# EAGLE design labwiz-module_full_breakout (EAGLE 6.5.0)

## Sheet 1 of 2
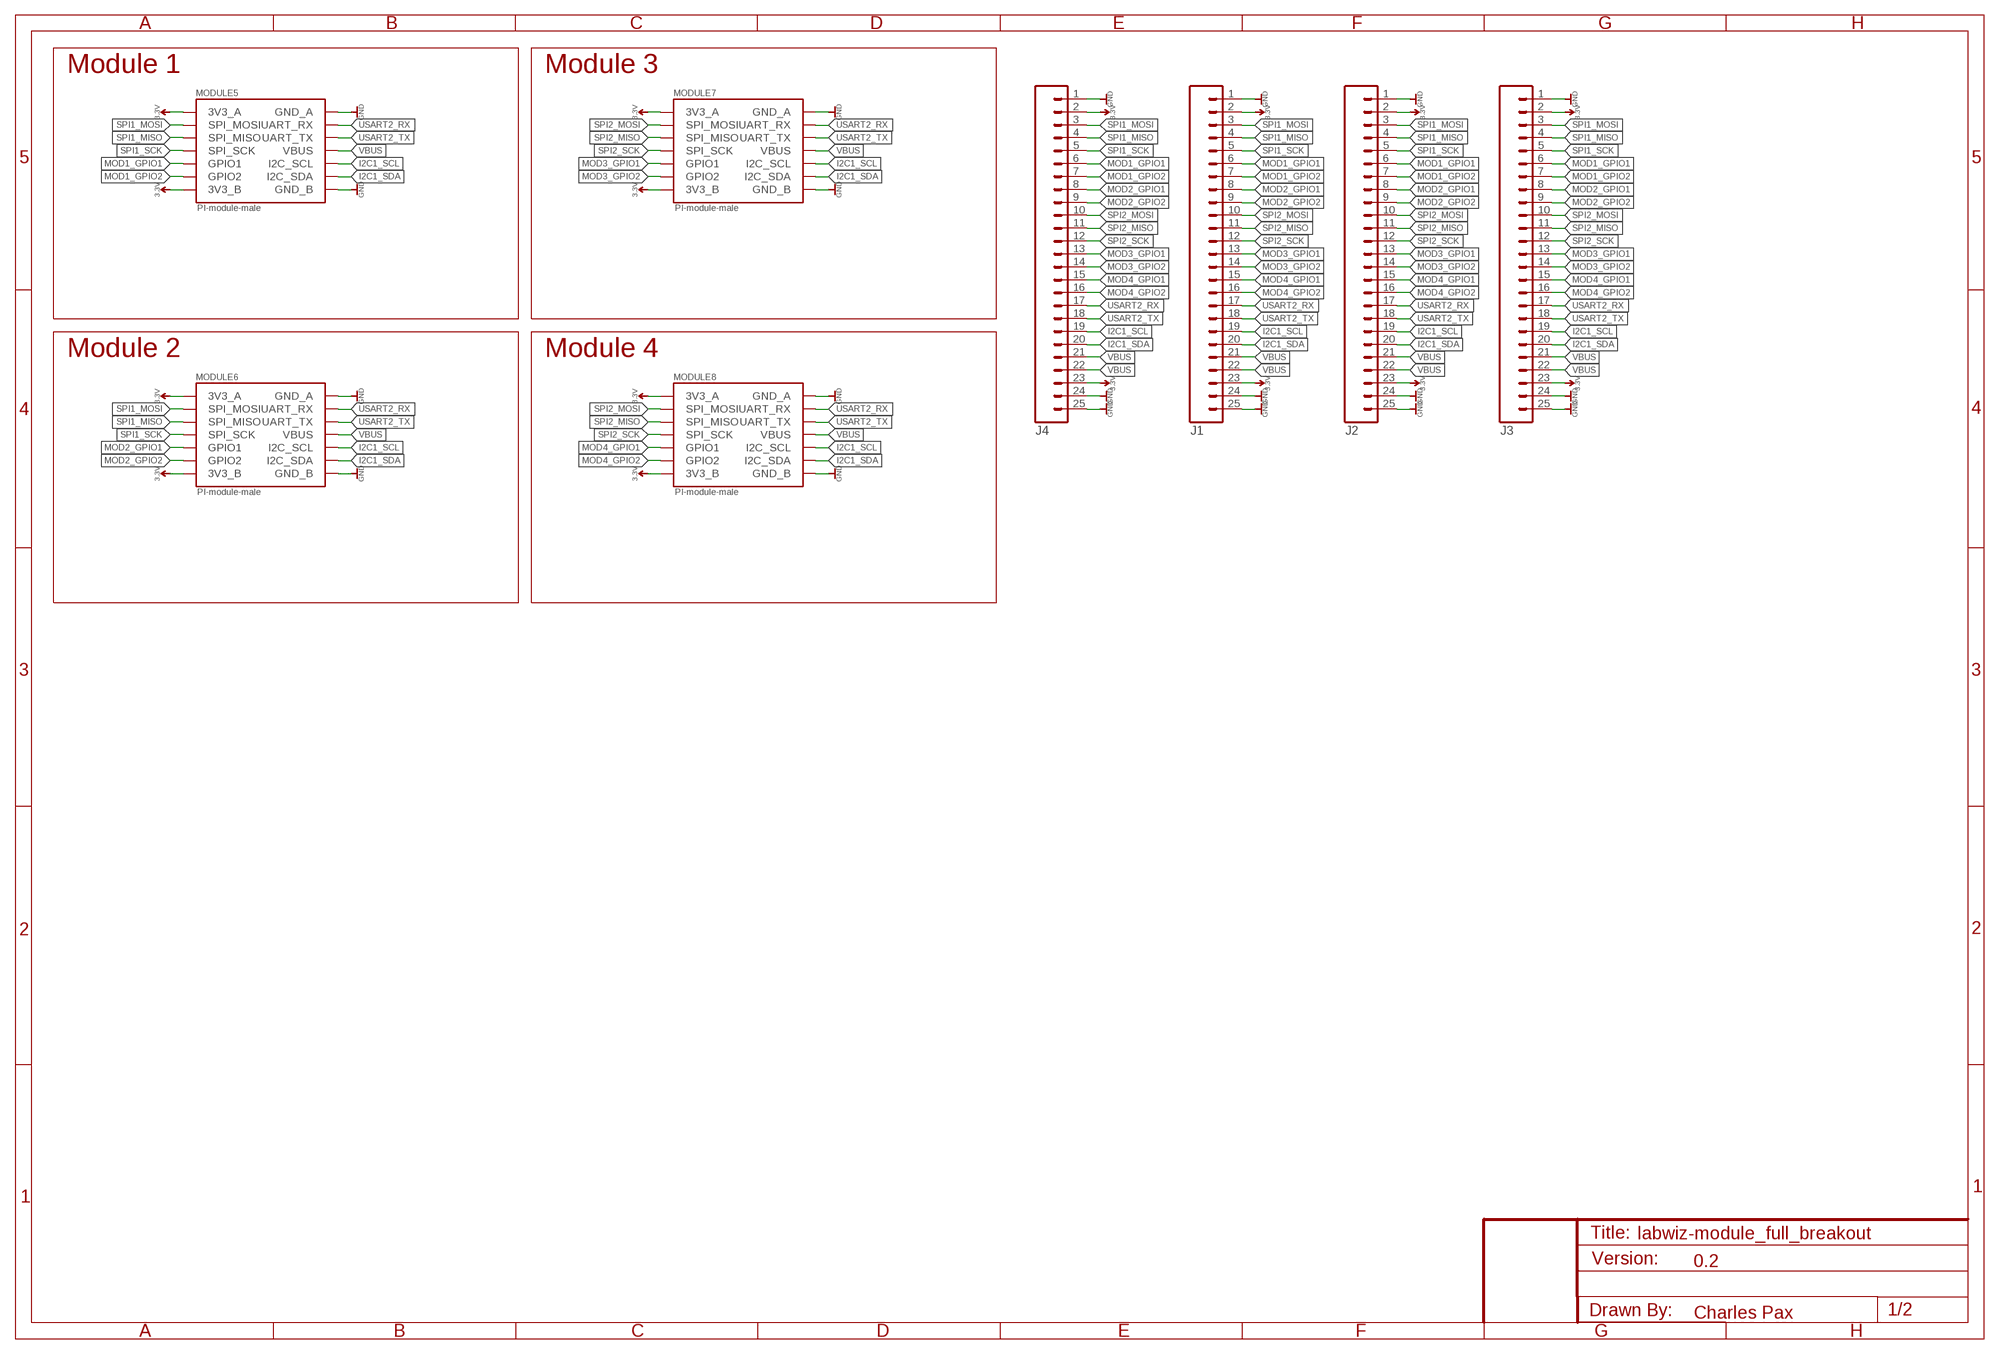
[diagram p0: schematic, sheet 1]

### Parts
J1  M25PTH  [1X25]
J2  M25PTH  [1X25]
J3  M25PTH  [1X25]
J4  M25PTH  [1X25]
MODULE5  PI-module-male  PAX_MODULE_EDGE_MALE_MODULE  [M07X2_2MM_EDGE]
MODULE6  PI-module-male  PAX_MODULE_EDGE_MALE_MODULE  [M07X2_2MM_EDGE]
MODULE7  PI-module-male  PAX_MODULE_EDGE_MALE_MODULE  [M07X2_2MM_EDGE]
MODULE8  PI-module-male  PAX_MODULE_EDGE_MALE_MODULE  [M07X2_2MM_EDGE]

### Nets
3.3V: J1.2 J1.23 J2.2 J2.23 J3.2 J3.23 J4.2 J4.23 MODULE5.P$1(3V3_B) MODULE5.P$13(3V3_A) MODULE6.P$1(3V3_B) MODULE6.P$13(3V3_A) MODULE7.P$1(3V3_B) MODULE7.P$13(3V3_A) MODULE8.P$1(3V3_B) MODULE8.P$13(3V3_A)
GND: J1.1 J1.24 J1.25 J2.1 J2.24 J2.25 J3.1 J3.24 J3.25 J4.1 J4.24 J4.25 MODULE5.P$2(GND_B) MODULE5.P$14(GND_A) MODULE6.P$2(GND_B) MODULE6.P$14(GND_A) MODULE7.P$2(GND_B) MODULE7.P$14(GND_A) MODULE8.P$2(GND_B) MODULE8.P$14(GND_A)
I2C1_SCL: J1.19 J2.19 J3.19 J4.19 MODULE5.P$6(I2C_SCL) MODULE6.P$6(I2C_SCL) MODULE7.P$6(I2C_SCL) MODULE8.P$6(I2C_SCL)
I2C1_SDA: J1.20 J2.20 J3.20 J4.20 MODULE5.P$4(I2C_SDA) MODULE6.P$4(I2C_SDA) MODULE7.P$4(I2C_SDA) MODULE8.P$4(I2C_SDA)
MOD1_GPIO1: J1.6 J2.6 J3.6 J4.6 MODULE5.P$5(GPIO1)
MOD1_GPIO2: J1.7 J2.7 J3.7 J4.7 MODULE5.P$3(GPIO2)
MOD2_GPIO1: J1.8 J2.8 J3.8 J4.8 MODULE6.P$5(GPIO1)
MOD2_GPIO2: J1.9 J2.9 J3.9 J4.9 MODULE6.P$3(GPIO2)
MOD3_GPIO1: J1.13 J2.13 J3.13 J4.13 MODULE7.P$5(GPIO1)
MOD3_GPIO2: J1.14 J2.14 J3.14 J4.14 MODULE7.P$3(GPIO2)
MOD4_GPIO1: J1.15 J2.15 J3.15 J4.15 MODULE8.P$5(GPIO1)
MOD4_GPIO2: J1.16 J2.16 J3.16 J4.16 MODULE8.P$3(GPIO2)
SPI1_MISO: J1.4 J2.4 J3.4 J4.4 MODULE5.P$9(SPI_MISO) MODULE6.P$9(SPI_MISO)
SPI1_MOSI: J1.3 J2.3 J3.3 J4.3 MODULE5.P$11(SPI_MOSI) MODULE6.P$11(SPI_MOSI)
SPI1_SCK: J1.5 J2.5 J3.5 J4.5 MODULE5.P$7(SPI_SCK) MODULE6.P$7(SPI_SCK)
SPI2_MISO: J1.11 J2.11 J3.11 J4.11 MODULE7.P$9(SPI_MISO) MODULE8.P$9(SPI_MISO)
SPI2_MOSI: J1.10 J2.10 J3.10 J4.10 MODULE7.P$11(SPI_MOSI) MODULE8.P$11(SPI_MOSI)
SPI2_SCK: J1.12 J2.12 J3.12 J4.12 MODULE7.P$7(SPI_SCK) MODULE8.P$7(SPI_SCK)
USART2_RX: J1.17 J2.17 J3.17 J4.17 MODULE5.P$12(UART_RX) MODULE6.P$12(UART_RX) MODULE7.P$12(UART_RX) MODULE8.P$12(UART_RX)
USART2_TX: J1.18 J2.18 J3.18 J4.18 MODULE5.P$10(UART_TX) MODULE6.P$10(UART_TX) MODULE7.P$10(UART_TX) MODULE8.P$10(UART_TX)
VBUS: J1.21 J1.22 J2.21 J2.22 J3.21 J3.22 J4.21 J4.22 MODULE5.P$8(VBUS) MODULE6.P$8(VBUS) MODULE7.P$8(VBUS) MODULE8.P$8(VBUS)

### Notes on the sheet
- Module 1 | Module 3
- Module 2 | Module 4
- 0.2
- Charles Pax

## Sheet 2 of 2

## Library data of the parts
J1-J4 = SparkFun-Connectors:M25: 1x25 .1" header
MODULE5-MODULE8 = PaxInstruments-Connectors:PAX_MODULE; MF: Pax Instruments; MPN: PIxxxx

## Net classes
0 Digital signal: width 0.1 mm, drill 0.2 mm, clearance 0.15 mm
1 3.3V power: width 0.1 mm, drill 0.2 mm, clearance 0.15 mm
2 RTC battery: width 0.1 mm, drill 0.2 mm, clearance 0.15 mm
3 5V power: width 0.1 mm, drill 0.2 mm, clearance 0.15 mm
4 Analog signal: width 0.1 mm, drill 0.2 mm, clearance 0.15 mm
5 GND: width 0.1 mm, drill 0.2 mm, clearance 0.15 mm

## Board
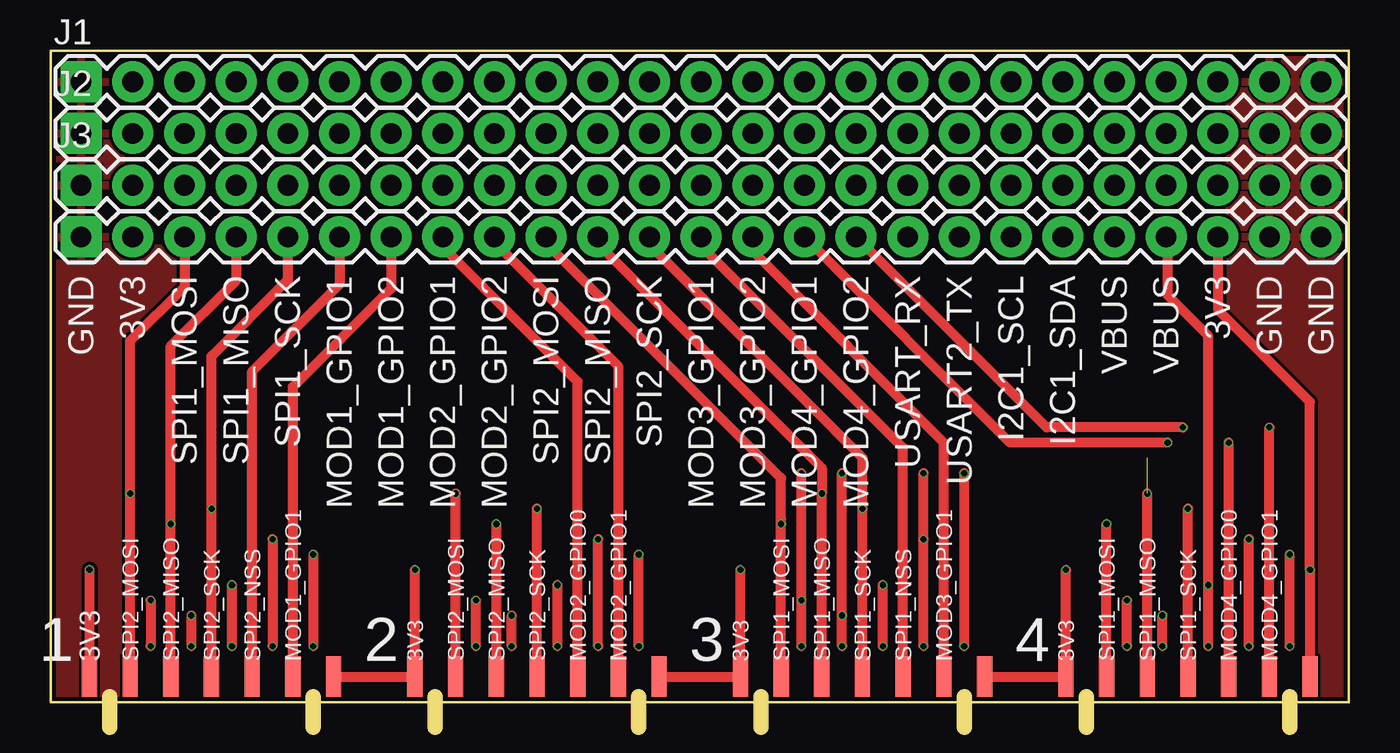
[diagram p1: board, top side]
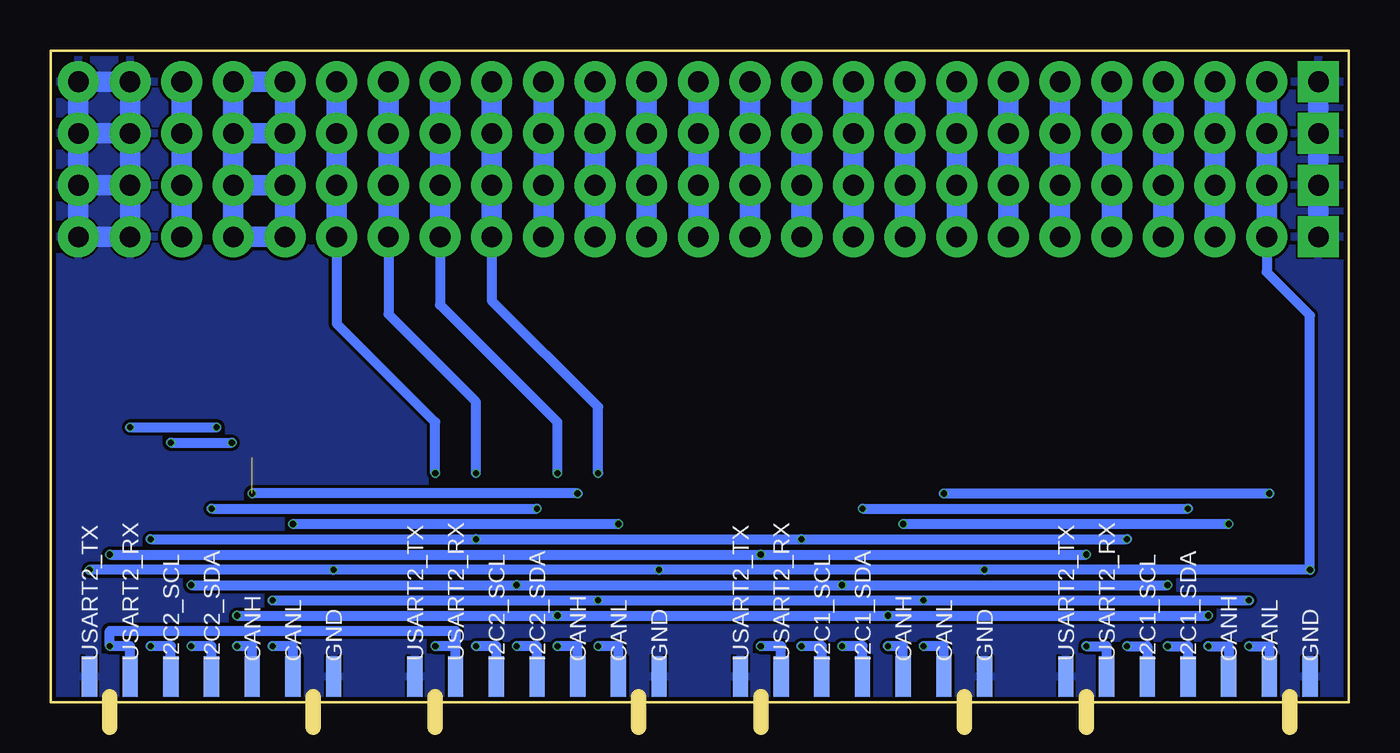
[diagram p2: board, bottom side, seen from below]

Size 63.8 x 32 mm. Coordinates in mm from the lower left corner, seen from the top.
Outline: 0,32 0,0 63.8,0 63.8,32 0,32
Copper layers (1*2+15*16): Top 0.017mm / dielectric 0.5mm / GND 0.017mm / dielectric 0.075mm / 3.3V 0.017mm / dielectric 0.5mm / Bottom 0.017mm
Design rules "PaxInstrument-T400 *": minimum track width 0.1mm, minimum drill 0.2mm, track to track 0.075mm, track to pad 0.075mm, pad to pad 0.075mm, via to via 0.075mm, smd to smd 0.075mm, copper to edge 0.2mm, drill to drill 0.2mm, minimum pad ring 0.5mm, minimum via ring 0.05mm, stop-mask expansion 0.01mm, vias tented up to drill 0.25mm, thermal gap 0.1mm
Milling: 8 lines

### Footprints (pad centres in the part's own frame; a part is rotated, then mirrored left to right if it is on the bottom)
1X25 = drill 1.016 pad 1.88 square: 1 0,0 | drill 1.016 pad 1.88: 2 2.54,0; 3 5.08,0; 4 7.62,0; 5 10.16,0; 6 12.7,0; 7 15.24,0; 8 17.78,0; 9 20.32,0; 10 22.86,0; 11 25.4,0; 12 27.94,0; 13 30.48,0; 14 33.02,0; 15 35.56,0; 16 38.1,0; 17 40.64,0; 18 43.18,0; 19 45.72,0; 20 48.26,0; 21 50.8,0; 22 53.34,0; 23 55.88,0; 24 58.42,0; 25 60.96,0
M07X2_2MM_EDGE = smd 0.75 x 2: P$1 0,-0.25; P$3 2,-0.25; P$5 4,-0.25; P$7 6,-0.25; P$9 8,-0.25; P$11 10,-0.25; P$13 12,-0.25 | smd 0.75 x 2 bottom: P$2 0,-0.25; P$4 2,-0.25; P$6 4,-0.25; P$8 6,-0.25; P$10 8,-0.25; P$12 10,-0.25; P$14 12,-0.25

### Placement (x,y rotation side)
J1  1.49,30.48 0 top
J2  1.49,27.94 0 top
J3  1.49,25.4 0 top
J4  1.49,22.86 0 top
MODULE5  13.9,1 180 top
MODULE6  29.9,1 180 top
MODULE7  45.9,1 180 top
MODULE8  61.9,1 180 top

### Tracks (layer width: path | path; a pad name or v marks a point on that pad's centre or on a via)
3.3V  (via drill 0.3)
  Top 0.5: MODULE5.P$13 v1.9,6.5 | MODULE8.P$1 v61.9,6.5 61.9,14.75 57.4,19.25 57.4,22.83 J4.23 | v17.9,6.5 MODULE6.P$13 MODULE5.P$1 | MODULE7.P$1 MODULE8.P$13 v49.9,6.5 | v33.9,6.5 MODULE7.P$13 MODULE6.P$1
  Bottom 0.5: v61.9,6.5 v49.9,6.5 v33.9,6.5 v17.9,6.5 v1.9,6.5 1.9,19 4.03,21.13 J4.2
  Bottom 1.016: J1.2 J2.2 J3.2 J4.2 | J1.23 J2.23 J3.23 J4.23
GND
  Bottom 1.016: J2.1 J1.1 J3.1 J4.1 | J2.25 J3.25 J3.24 J4.24 | J1.25 J4.25 J4.24 | J2.24 J1.24 | J1.24 J1.25 | J1.25 J2.25 | J2.25 J2.24 | J2.24 J4.24 | J1.24 J4.24
  pour Bottom: -0.1,32 -0.35,-0.25 63.9,0 63.9,32
  pour Top: -0.1,32 -0.35,-0.25 63.9,0 63.9,32
I2C1_SCL  (via drill 0.3)
  Top 0.5: v42.9,11.25 v42.9,2.75 v42.9,8 | v58.9,2.75 v58.9,8 | v10.9,8 v10.9,2.75 | v26.9,2.75 v26.9,8
  Bottom 0.5: MODULE7.P$6 41.9,2.75 v42.9,2.75 | v42.9,11.25 42.9,14.75 47.21,19.06 J4.19 | MODULE8.P$6 57.9,2.75 v58.9,2.75 | v58.9,8 v42.9,8 v26.9,8 v10.9,8 | v10.9,2.75 9.9,2.75 MODULE5.P$6 | MODULE6.P$6 25.9,2.75 v26.9,2.75
  Bottom 1.016: J1.19 J2.19 J3.19 J4.19
I2C1_SDA  (via drill 0.3)
  Top 0.5: v44.9,2.75 v44.9,11.25 | v60.9,2.75 v60.9,7.25 | v12.9,7.25 v12.9,2.75 | v28.9,2.75 v28.9,7.25
  Bottom 0.5: MODULE7.P$4 43.9,2.75 | 43.9,2.75 v44.9,2.75 | v44.9,11.25 44.9,13.75 49.75,18.6 J4.20 | MODULE8.P$4 59.9,2.75 v60.9,2.75 60.9,3.5 43.9,3.5 43.9,2.75 | v60.9,7.25 v28.9,7.25 v12.9,7.25 | v12.9,2.75 11.9,2.75 MODULE5.P$4 | MODULE6.P$4 27.9,2.75 v28.9,2.75
  Bottom 1.016: J1.20 J2.20 J3.20 J4.20
MOD1_GPIO1
  Top 0.5: MODULE5.P$5 9.9,16.25 14.19,20.54 J4.6
  Bottom 1.016: J3.6 J2.6 J1.6 J4.6
MOD1_GPIO2
  Top 0.5: MODULE5.P$3 11.9,15.5 16.73,20.33 J4.7
  Bottom 1.016: J3.7 J2.7 J1.7 J4.7
MOD2_GPIO1
  Top 0.5: MODULE6.P$5 25.9,15.75 19.27,22.38 J4.8
  Bottom 1.016: J3.8 J2.8 J1.8 J4.8
MOD2_GPIO2
  Top 0.5: MODULE6.P$3 27.9,16.5 21.81,22.59 J4.9
  Bottom 1.016: J3.9 J2.9 J1.9 J4.9
MOD3_GPIO1
  Top 0.5: MODULE7.P$5 41.9,12.5 31.97,22.43 J4.13
  Bottom 1.016: J1.13 J2.13 J3.13 J4.13
MOD3_GPIO2
  Top 0.5: MODULE7.P$3 43.9,12.75 34.51,22.14 J4.14
  Bottom 1.016: J3.14 J2.14 J1.14 J4.14
MOD4_GPIO1  (via drill 0.3)
  Top 0.5: MODULE8.P$5 v57.9,12.75 | v54.9,12.75 47.16,12.75 J4.15
  Bottom 0.5: v57.9,12.75 v54.9,12.75
  Bottom 1.016: J2.15 J1.15 J3.15 J4.15
MOD4_GPIO2  (via drill 0.3)
  Top 0.5: MODULE8.P$3 v59.9,13.5 | v55.65,13.5 48.95,13.5 J4.16
  Bottom 0.5: v59.9,13.5 v55.65,13.5
  Bottom 1.016: J2.16 J1.16 J3.16 J4.16
SPI1_MISO  (via drill 0.3)
  Top 0.5: MODULE5.P$9 v5.9,8.75 5.9,17.5 9.11,20.71 J4.4 | MODULE6.P$9 v21.9,8.75
  Bottom 0.5: v21.9,8.75 v5.9,8.75
  Bottom 1.016: J1.4 J2.4 J3.4 J4.4
SPI1_MOSI  (via drill 0.3)
  Top 0.5: MODULE5.P$11 v3.9,10.25 3.9,17.75 6.57,20.42 J4.3 | MODULE6.P$11 v19.9,10.25
  Bottom 0.5: v19.9,10.25 v3.9,10.25
  Bottom 1.016: J2.3 J1.3 J3.3 J4.3
SPI1_SCK  (via drill 0.3)
  Top 0.5: MODULE5.P$7 v7.9,9.5 7.9,17 11.65,20.75 J4.5 | MODULE6.P$7 v23.9,9.5
  Bottom 0.5: v23.9,9.5 v7.9,9.5
  Bottom 1.016: J3.5 J2.5 J1.5 J4.5
SPI2_MISO  (via drill 0.3)  (1 unrouted)
  Top 0.5: MODULE7.P$9 v37.9,10.25 37.9,11.5 26.89,22.51 J4.11 | MODULE8.P$9 v53.9,10.25
  Bottom 0.5: v37.9,10.25 v53.9,10.25
  Bottom 1.016: J1.11 J2.11 J3.11 J4.11
SPI2_MOSI  (via drill 0.3)
  Top 0.5: MODULE7.P$11 v35.9,8.75 | v35.9,8.75 35.9,11 24.35,22.55 J4.10 | MODULE8.P$11 v51.9,8.75 | v35.9,8.75 35.9,9
  Bottom 0.5: v51.9,8.75 v35.9,8.75
  Bottom 1.016: J3.10 J2.10 J1.10 J4.10
SPI2_SCK  (via drill 0.3)
  Top 0.5: MODULE7.P$7 v39.9,9.5 39.9,12 29.43,22.47 J4.12 | MODULE8.P$7 v55.9,9.5
  Bottom 0.5: v55.9,9.5 v39.9,9.5
  Bottom 1.016: J1.12 J2.12 J3.12 J4.12
USART2_RX  (via drill 0.3)
  Top 0.5: v36.9,11.25 v36.9,5 v36.9,2.75 | v52.9,2.75 v52.9,5 | v4.9,5 v4.9,2.75 | v20.9,2.75 v20.9,5
  Bottom 0.5: MODULE7.P$12 35.9,2.75 v36.9,2.75 | v36.9,11.25 36.9,14.5 42.13,19.73 J4.17 | MODULE8.P$12 51.9,2.75 v52.9,2.75 | v52.9,5 v36.9,5 v20.9,5 v4.9,5 | v4.9,2.75 3.9,2.75 MODULE5.P$12 | MODULE6.P$12 19.9,2.75 v20.9,2.75
  Bottom 1.016: J1.17 J2.17 J3.17 J4.17
USART2_TX  (via drill 0.3)
  Top 0.5: v38.9,11.25 v38.9,2.75 v38.9,4.25 | v54.65,2.75 v54.65,4.25 | v6.9,4.25 v6.9,2.75 | v22.65,2.75 v22.65,4.25
  Bottom 0.5: MODULE7.P$10 37.9,2.75 v38.9,2.75 | v38.9,11.25 38.9,13.75 44.67,19.52 J4.18 | MODULE8.P$10 53.9,2.75 v54.65,2.75 | v54.65,4.25 v38.9,4.25 v22.65,4.25 v6.9,4.25 | v6.9,2.75 5.9,2.75 MODULE5.P$10 | MODULE6.P$10 21.9,2.75 v22.65,2.75
  Bottom 1.016: J1.18 J2.18 J3.18 J4.18
VBUS  (via drill 0.3)
  Top 0.5: v56.9,2.75 v56.9,5.75 56.9,18 54.9,20 54.9,22.79 J4.22 | v8.9,5.75 v8.9,2.75 | v24.9,2.75 v24.9,5.75 | v40.9,2.75 v40.9,5.75
  Bottom 0.5: MODULE8.P$8 55.9,2.75 v56.9,2.75 | v56.9,5.75 v40.9,5.75 v24.9,5.75 v8.9,5.75 | v8.9,2.75 7.9,2.75 MODULE5.P$8 | MODULE6.P$8 23.9,2.75 v24.9,2.75 | MODULE7.P$8 39.9,2.75 v40.9,2.75
  Bottom 1.016: J2.21 J1.21 J1.22 J2.22 | J2.21 J3.21 J3.22 J4.22 | J4.22 J4.21 J2.21 | J2.21 J2.22 | J2.22 J4.22

### Text on the board
tPlace: GND | 3V3 | SPI1_MOSI | SPI1_MISO | SPI1_SCK | MOD1_GPIO1 | MOD1_GPIO2 | MOD2_GPIO1 | MOD2_GPIO2 | SPI2_MOSI | SPI2_MISO | SPI2_SCK | MOD3_GPIO1 | MOD3_GPIO2 | MOD4_GPIO1 | MOD4_GPIO2 | USART_RX | USART2_TX | I2C1_SCL | I2C1_SDA | VBUS | VBUS | 3V3 | GND | GND | 1 | 3V3 | SPI2_MOSI | SPI2_MISO | SPI2_SCK | SPI2_NSS | MOD1_GPIO1 | 2 | 3V3 | SPI2_MOSI | SPI2_MISO | SPI2_SCK | MOD2_GPIO0 | MOD2_GPIO1 | 3 | 3V3 | SPI1_MOSI | SPI1_MISO | SPI1_SCK | SPI1_NSS | MOD3_GPIO1 | 4 | 3V3 | SPI1_MOSI | SPI1_MISO | SPI1_SCK | MOD4_GPIO0 | MOD4_GPIO1
bPlace: GND | CANL | CANH | I2C1_SDA | I2C1_SCL | USART2_RX | USART2_TX | GND | CANL | CANH | I2C1_SDA | I2C1_SCL | USART2_RX | USART2_TX | GND | CANL | CANH | I2C2_SDA | I2C2_SCL | USART2_RX | USART2_TX | GND | CANL | CANH | I2C2_SDA | I2C2_SCL | USART2_RX | USART2_TX